# EAGLE design brainslug_2 (EAGLE 6.5.0)
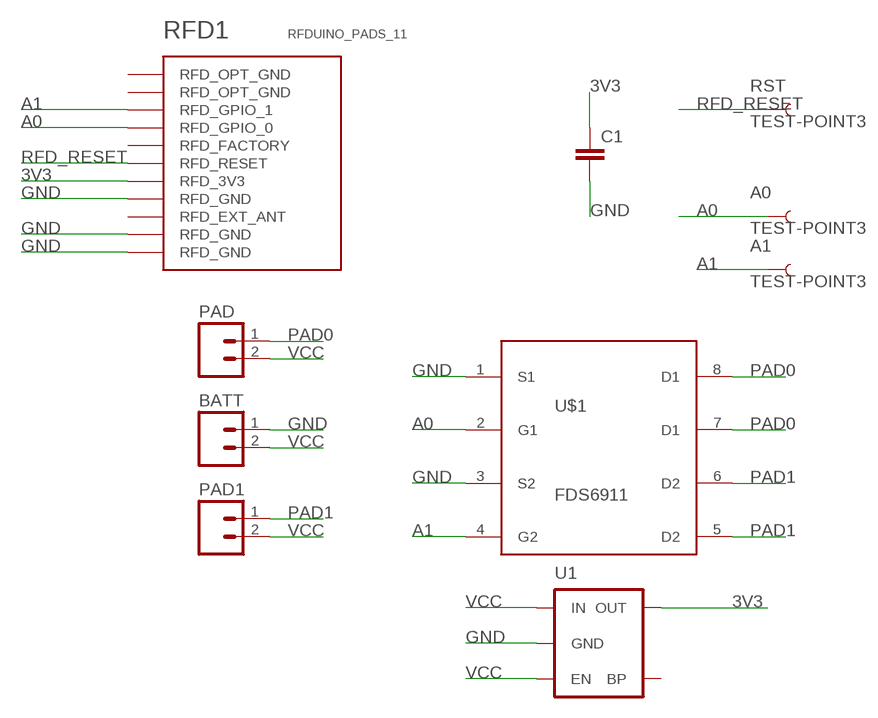
[diagram p0: schematic, sheet 1]

## Parts
A0  TEST-POINT3  [PAD.03X.03]
A1  TEST-POINT3  [PAD.03X.03]
BATT  M02-JST-2MM-SMT  [JST-2-SMD]
C1  CAP  [C3216]
PAD  M02-JST-2MM-SMT  [JST-2-SMD]
PAD1  M02-JST-2MM-SMT  [JST-2-SMD]
RFD1  RFDUINO_PADS_11  [RFDUINO_PADS]
RST  TEST-POINT3  [PAD.03X.03]
U1  MIC52053.3V  [SOT23-5]
U$1  FDS6911  [SO8]

## Nets
3V3: C1.1 RFD1.RFD_3V3 U1.5(OUT)
A0: A0.P$1 RFD1.RFD_GPIO_0 U$1.2(G1)
A1: A1.P$1 RFD1.RFD_GPIO_1 U$1.4(G2)
GND: BATT.1 C1.2 RFD1.RFD_GND@0(RFD_GND) RFD1.RFD_GND@1(RFD_GND) RFD1.RFD_GND@2(RFD_GND) U1.2(GND) U$1.1(S1) U$1.3(S2)
PAD0: PAD.1 U$1.7(D1) U$1.8(D1)
PAD1: PAD1.1 U$1.5(D2) U$1.6(D2)
RFD_RESET: RFD1.RFD_RESET RST.P$1
VCC: BATT.2 PAD1.2 PAD.2 U1.1(IN) U1.3(EN)
Unconnected: RFD1.RFD_EXT_ANT RFD1.RFD_FACTORY RFD1.RFD_OPT_GND@0(RFD_OPT_GND) RFD1.RFD_OPT_GND@1(RFD_OPT_GND) U1.4(BP)

## Library data of the parts
A0 A1 RST = SparkFun-Passives:TEST-POINT: Bare copper test points for troubleshooting or ICT
BATT PAD PAD1 = SparkFun-Connectors:M02: Header 2 Standard 2-pin 0.1" header. Use with straight break away headers (SKU : PRT-00116), right angle break away headers (PRT-00553), swiss pins (PRT-00743), machine pins (PRT-00117), and female headers (PRT-00115). Molex polarized connector foot print use with SKU : PRT-08233 with associated crimp pins and housings.
C1 = AKA_test:CAP: Capacitor Standard 0603 ceramic capacitor, and 0.1" leaded capacitor.
RFD1 = AKA_test:RFDUINO_PADS_11: RFDuino solder pads for custom breakout boards. This is the power and programming side of the board, not the side with general GPIOs
U1 = SparkFun-PowerIC:MIC5205: MIC5205 150mA vreg 3.3V - VREG-00822 5V - VREG-00823; PROD_ID: VREG-00822
U$1 = AKA_test:FDS6911: FDS6911 Dual N-Channel Logic Level PowerTrench® MOSFET 20V, 7.5A, 13mΩ

## Board
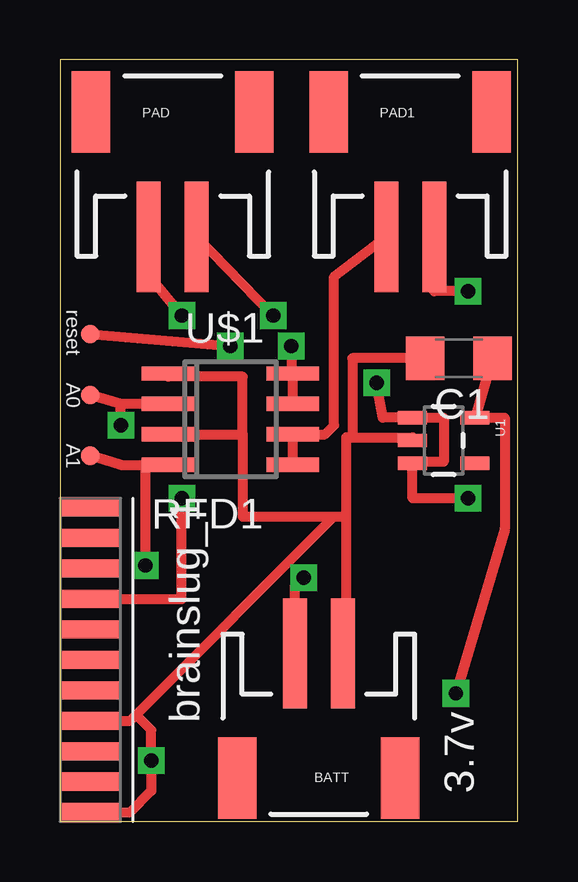
[diagram p1: board, top side]
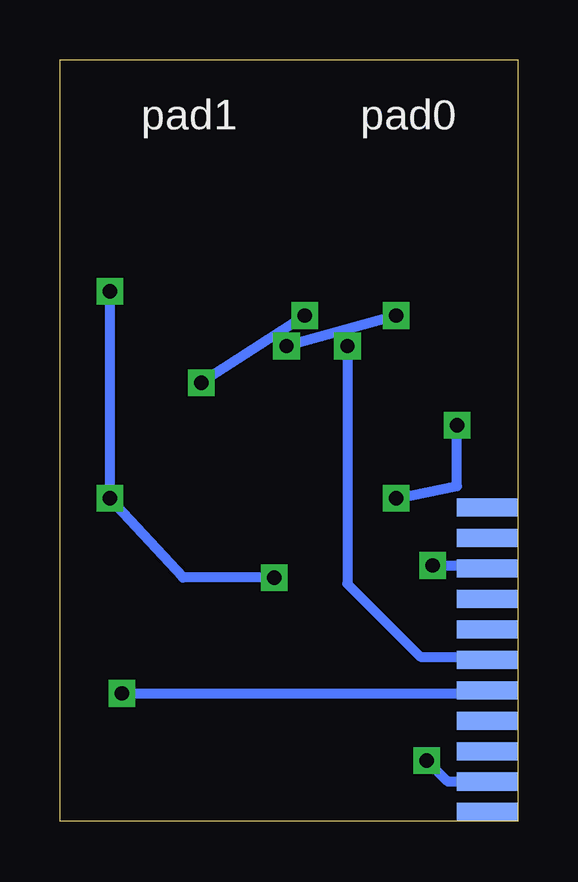
[diagram p2: board, bottom side, seen from below]

Size 19.1 x 31.74 mm. Coordinates in mm from the lower left corner, seen from the top.
Outline: 0,0 19.1,0 19.1,31.74 0,31.74 0,0
Copper layers (1*16): Top 0.035mm / dielectric 1.5mm / Bottom 0.035mm
Design rules "SparkFun": minimum track width 8mil, minimum drill 20mil, track to track 8mil, track to pad 8mil, pad to pad 8mil, via to via 8mil, smd to smd 8mil, copper to edge 10mil, drill to drill 8mil, minimum pad ring 12mil, minimum via ring 10mil, stop-mask expansion 4mil, vias tented up to drill 25mil, thermal gap 10mil

### Footprints (pad centres in the part's own frame; a part is rotated, then mirrored left to right if it is on the bottom)
PAD.03X.03 = smd 0.762 x 0.762: P$1 0,0
JST-2-SMD = smd 1 x 4.6: 1 -1,-3.7; 2 1,-3.7 | smd 1.6 x 3.4: NC1 -3.4,1.5; NC2 3.4,1.5
C3216 = smd 1.6 x 1.8: 1 -1.4,0; 2 1.4,0
RFDUINO_PADS = smd 2.54 x 0.762: RFD_3V1 1.27,5.461; RFD_EXT_ANT 1.27,2.921; RFD_FACTORY 1.27,8.001; RFD_GND@0 1.27,4.191; RFD_GND@2 1.27,0.381; RFD_GND@4 1.27,1.651; RFD_GPIO_0 1.27,9.271; RFD_GPIO_2 1.27,10.541; RFD_OPT_GND@0 1.27,13.081; RFD_OPT_GND@2 1.27,13.081; RFD_OPT_GND@4 1.27,11.811; RFD_RESET1 1.27,6.731 | smd 2.54 x 0.762 bottom: RFD_3V3 1.27,5.461; RFD_EXT_ANT1 1.27,2.921; RFD_FACTORY1 1.27,8.001; RFD_GND@1 1.27,1.651; RFD_GND@3 1.27,4.191; RFD_GND@5 1.27,0.381; RFD_GPIO_1 1.27,10.541; RFD_GPIO_3 1.27,9.271; RFD_OPT_GND@1 1.27,11.811; RFD_OPT_GND@3 1.27,13.081; RFD_RESET 1.27,6.731
SOT23-5 = smd 0.55 x 1.2: 1 -0.95,-1.3; 2 0,-1.3; 3 0.95,-1.3; 4 0.95,1.3; 5 -0.95,1.3
SO8 = smd 0.6 x 2.2: 1 -1.905,-2.6; 2 -0.635,-2.6; 3 0.635,-2.6; 4 1.905,-2.6; 5 1.905,2.6; 6 0.635,2.6; 7 -0.635,2.6; 8 -1.905,2.6

### Placement (x,y rotation side)
A0  1.27,17.78 0 top
A1  1.27,15.24 0 top
BATT  10.79,3.3 180 top
C1  16.64,19.3 180 top
PAD  4.7,28.07 0 top
PAD1  14.61,28.07 0 top
RFD1  0,0 0 top
RST  1.27,20.32 0 top
U1  16,15.88 270 top
U$1  7.11,16.76 270 top

### Tracks (layer width: path | path; a pad name or v marks a point on that pad's centre or on a via)
3V3  (via drill 0.6)
  Top 0.406: C1.1 17.3,16.76 U1.5 18.54,16.82 18.54,12.19 v16.51,5.33
  Bottom 0.406: v16.51,5.33 1.27,5.33 RFD1.RFD_3V3
A0  (via drill 0.6)
  Top 0.406: U$1.2 2.54,17.4 | 2.54,17.4 A0.P$1 | RFD1.RFD_GPIO_0 5.08,9.27 v5.08,13.46 | v2.54,16.51 2.54,17.4
  Bottom 0.406: v5.08,13.46 2.54,13.97 v2.54,16.51
A1  (via drill 0.6)
  Top 0.406: U$1.4 3.56,14.86 | A1.P$1 2.54,14.86 3.56,14.86 | 3.56,14.86 v3.56,10.67
  Bottom 0.406: v3.56,10.67 1.27,10.67 RFD1.RFD_GPIO_1
GND  (via drill 0.6)
  Top 0.406: C1.2 12.19,19.3 12.19,16 | 12.19,16 14.7,16 U1.2 | BATT.1 11.94,7 11.94,12.7 | 11.94,12.7 11.94,16 12.19,16 | U$1.3 7.62,16.13 | 7.62,16.13 7.62,18.54 4.51,18.54 U$1.1 | 7.62,16.13 7.62,12.7 11.43,12.7 | 11.43,12.7 11.94,12.7 | RFD1.RFD_GND@0 2.92,4.19 3.17,4.45 | 3.17,4.45 11.43,12.7 | RFD1.RFD_GND@2 2.92,0.38 3.81,1.27 v3.81,2.54 3.81,3.81 3.17,4.45
  Bottom 0.406: RFD1.RFD_GND@1 2.92,1.65 v3.81,2.54
PAD0  (via drill 0.6)
  Top 0.406: U$1.7 U$1.8 9.65,18.73 v9.65,19.81 | PAD.1 3.7,22.75 v5.08,21.08
  Bottom 0.406: v5.08,21.08 v9.65,19.81
PAD1
  Top 0.406: U$1.5 U$1.6 11.05,16.13 11.43,16.51 11.43,22.7 PAD1.1
RFD_RESET  (via drill 0.6)
  Top 0.406: RST.P$1 v7.11,19.81
  Bottom 0.406: v7.11,19.81 7.11,9.91 4.06,6.86 1.27,6.86 RFD1.RFD_RESET
VCC  (via drill 0.6)
  Top 0.406: v17.02,13.46 14.7,13.46 U1.3 14.7,14.99 16,14.99 16,16.82 U1.1 13.46,16.82 v13.21,18.29 | BATT.2 9.79,9.79 v10.16,10.16 | v8.89,21.08 PAD.2 | v17.02,22.1 15.61,22.1 PAD1.2
  Bottom 0.406: v17.02,22.1 v17.02,13.46 13.97,10.16 v10.16,10.16 | v13.21,18.29 v8.89,21.08

### Text on the board
tPlace: reset | A0 | A1 | brainslug_1 | 3.7v
bPlace: pad0 | pad1